# EAGLE design TLC5947_Breakout (EAGLE 6.0)
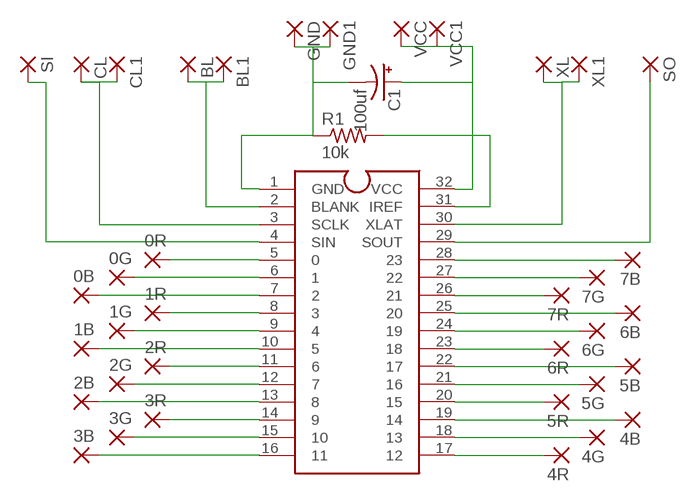
[diagram p0: schematic, sheet 1]

## Parts
0B  SMD2  [SMD1,27-2,54]
0G  SMD2  [SMD1,27-2,54]
0R  SMD2  [SMD1,27-2,54]
1B  SMD2  [SMD1,27-2,54]
1G  SMD2  [SMD1,27-2,54]
1R  SMD2  [SMD1,27-2,54]
2B  SMD2  [SMD1,27-2,54]
2G  SMD2  [SMD1,27-2,54]
2R  SMD2  [SMD1,27-2,54]
3B  SMD2  [SMD1,27-2,54]
3G  SMD2  [SMD1,27-2,54]
3R  SMD2  [SMD1,27-2,54]
4B  SMD2  [SMD1,27-2,54]
4G  SMD2  [SMD1,27-2,54]
4R  SMD2  [SMD1,27-2,54]
5B  SMD2  [SMD1,27-2,54]
5G  SMD2  [SMD1,27-2,54]
5R  SMD2  [SMD1,27-2,54]
6B  SMD2  [SMD1,27-2,54]
6G  SMD2  [SMD1,27-2,54]
6R  SMD2  [SMD1,27-2,54]
7B  SMD2  [SMD1,27-2,54]
7G  SMD2  [SMD1,27-2,54]
7R  SMD2  [SMD1,27-2,54]
BL  SMD2  [SMD1,27-2,54]
BL1  SMD2  [SMD1,27-2,54]
C1  100uf  CPOL-USE2.5-6  [E2,5-6]
CL  SMD2  [SMD1,27-2,54]
CL1  SMD2  [SMD1,27-2,54]
GND  SMD2  [SMD1,27-2,54]
GND1  SMD2  [SMD1,27-2,54]
R1  10k  R-US_0207/10  [0207/10]
SI  SMD2  [SMD1,27-2,54]
SO  SMD2  [SMD1,27-2,54]
U$1  TLC5947DAC  [DAP38]
VCC  SMD2  [SMD1,27-2,54]
VCC1  SMD2  [SMD1,27-2,54]
XL  SMD2  [SMD1,27-2,54]
XL1  SMD2  [SMD1,27-2,54]

## Nets
GND: C1.- GND1.1(P) GND.1(P) R1.1 U$1.1(GND)
N$1: R1.2 U$1.31(IREF)
N$2: U$1.30(XLAT) XL1.1(P) XL.1(P)
N$3: 0R.1(P) U$1.5
N$4: 0G.1(P) U$1.6
N$5: 0B.1(P) U$1.7
N$6: 1R.1(P) U$1.8
N$7: 1G.1(P) U$1.9
N$8: 1B.1(P) U$1.10
N$9: 2R.1(P) U$1.11
N$10: 2G.1(P) U$1.12
N$11: 2B.1(P) U$1.13
N$12: 3R.1(P) U$1.14
N$13: 3G.1(P) U$1.15
N$14: 3B.1(P) U$1.16
N$15: 4R.1(P) U$1.17
N$16: 4G.1(P) U$1.18
N$17: 4B.1(P) U$1.19
N$18: 5R.1(P) U$1.20
N$19: 5G.1(P) U$1.21
N$20: 5B.1(P) U$1.22
N$21: 6R.1(P) U$1.23
N$22: 6G.1(P) U$1.24
N$23: 6B.1(P) U$1.25
N$24: 7R.1(P) U$1.26
N$25: 7G.1(P) U$1.27
N$26: 7B.1(P) U$1.28
N$27: SI.1(P) U$1.4(SIN)
N$28: SO.1(P) U$1.29(SOUT)
N$31: CL1.1(P) CL.1(P) U$1.3(SCLK)
N$32: BL1.1(P) BL.1(P) U$1.2(BLANK)
VCC: C1.+ U$1.32(VCC) VCC1.1(P) VCC.1(P)

## Library data of the parts
0B 0G 0R 1B 1G 1R 2B 2G 2R 3B 3G 3R 4B 4G 4R 5B 5G 5R 6B 6G 6R 7B 7G 7R BL BL1 CL CL1 GND GND1 SI SO VCC VCC1 XL XL1 = wirepad:SMD2: SMD PAD
C1 = resistor:CPOL-US: POLARIZED CAPACITOR, American symbol
R1 = resistor:R-US_: RESISTOR, American symbol
U$1 = RazorConcepts:TLC5947DAC

## Board
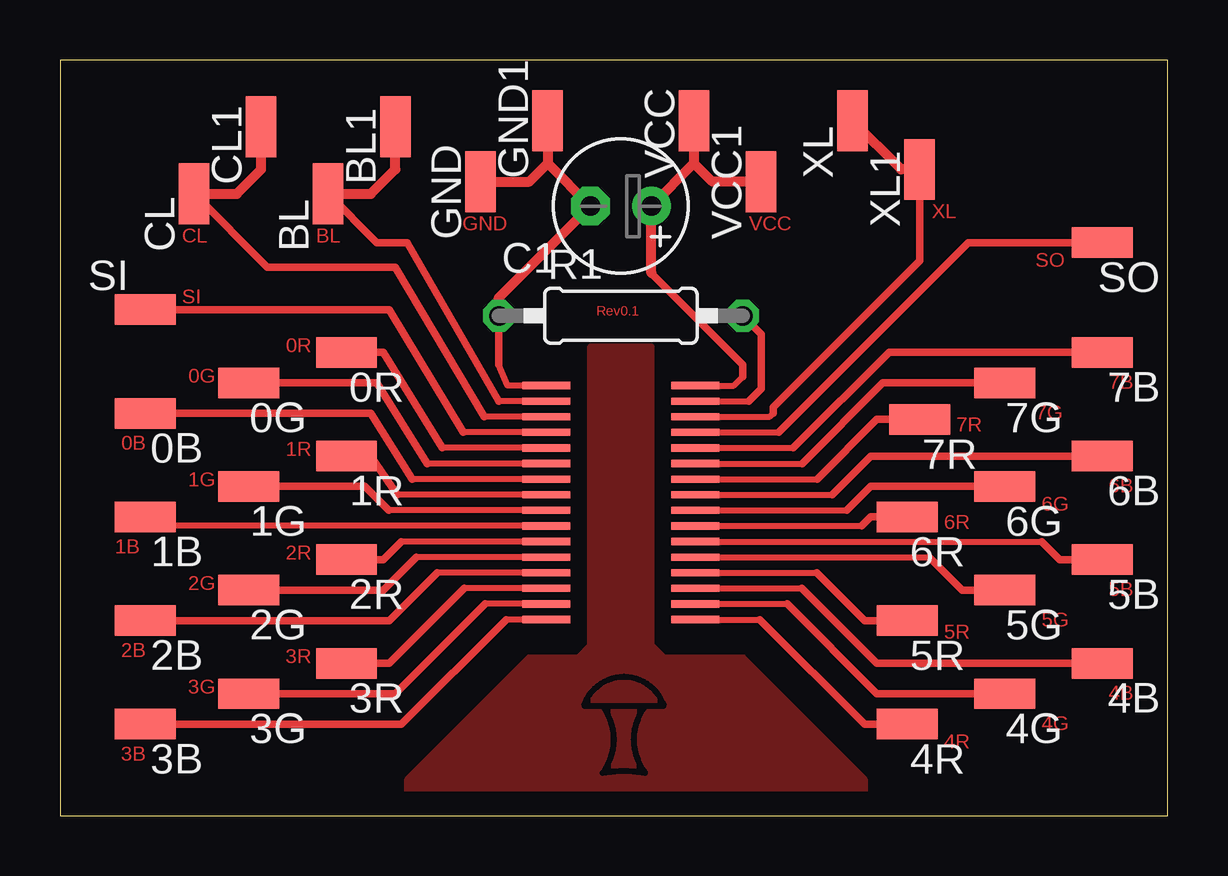
[diagram p1: board, top side]

Size 46.15 x 31.49 mm. Coordinates in mm from the lower left corner, seen from the top.
Outline: 0,0 46.15,0 46.15,31.49 0,31.49 0,0
Copper layers (1*16): Top 0.035mm / dielectric 1.5mm / Bottom 0.035mm
Design rules: minimum track width 10mil, minimum drill 24mil, track to track 8mil, track to pad 8mil, pad to pad 8mil, via to via 8mil, smd to smd 8mil, copper to edge 40mil, drill to drill 8mil, minimum pad ring 10mil, minimum via ring 8mil, stop-mask expansion 4mil, vias tented up to drill 0mil, thermal gap 10mil
tRestrict: 7 lines

### Footprints (pad centres in the part's own frame; a part is rotated, then mirrored left to right if it is on the bottom)
SMD1,27-2,54 = smd 1.27 x 2.54: 1 0,0
E2,5-6 = drill 0.813 pad 1.6: + -1.27,0 | drill 0.813 pad 1.6 octagon: - 1.27,0
0207/10 = drill 0.813 octagon: 1 -5.08,0; 2 5.08,0
DAP38 = smd 2 x 0.3: 1 -3.1,0.65; 2 -3.1,0; 3 -3.1,-0.65; 4 -3.1,-1.3; 5 -3.1,-1.95; 6 -3.1,-2.6; 7 -3.1,-3.25; 8 -3.1,-3.9; 9 -3.1,-4.55; 10 -3.1,-5.2; 11 -3.1,-5.85; 12 -3.1,-6.5; 13 -3.1,-7.15; 14 -3.1,-7.8; 15 -3.1,-8.45; 16 -3.1,-9.1; 17 3.1,-9.1; 18 3.1,-8.45; 19 3.1,-7.8; 20 3.1,-7.15; 21 3.1,-6.5; 22 3.1,-5.85; 23 3.1,-5.2; 24 3.1,-4.55; 25 3.1,-3.9; 26 3.1,-3.25; 27 3.1,-2.6; 28 3.1,-1.95; 29 3.1,-1.3; 30 3.1,-0.65; 31 3.1,0; 32 3.1,0.65

### Placement (x,y rotation side)
0B  3.56,16.76 90 top
0G  7.87,18.03 90 top
0R  11.94,19.3 90 top
1B  3.56,12.45 90 top
1G  7.87,13.72 90 top
1R  11.94,14.99 90 top
2B  3.56,8.13 90 top
2G  7.87,9.4 90 top
2R  11.94,10.67 90 top
3B  3.56,3.81 90 top
3G  7.87,5.08 90 top
3R  11.94,6.35 90 top
4B  43.43,6.35 90 top
4G  39.37,5.08 90 top
4R  35.31,3.81 90 top
5B  43.43,10.67 90 top
5G  39.37,9.4 90 top
5R  35.31,8.13 90 top
6B  43.43,14.99 90 top
6G  39.37,13.72 90 top
6R  35.31,12.45 90 top
7B  43.43,19.3 90 top
7G  39.37,18.03 90 top
7R  35.81,16.51 90 top
BL  11.18,25.91 0 top
BL1  13.97,28.7 0 top
C1  23.37,25.4 180 top
CL  5.59,25.91 0 top
CL1  8.38,28.7 0 top
GND  17.53,26.42 0 top
GND1  20.32,28.96 0 top
R1  23.37,20.83 0 top
SI  3.56,21.08 270 top
SO  43.43,23.88 90 top
U$1  23.37,17.27 0 top
VCC  26.42,28.96 0 top
VCC1  29.21,26.42 0 top
XL  33.02,28.96 0 top
XL1  35.81,26.92 0 top

### Tracks (layer width: path | path; a pad name or v marks a point on that pad's centre or on a via)
GND
  Top 0.254: U$1.1 18.65,17.92 18.29,18.8
  Top 0.305: 18.29,18.8 R1.1
  Top 0.406: R1.1 18.29,21.59 C1.- 20.32,27.18 | GND.1 19.56,26.42 20.32,27.18 | GND1.1 20.32,27.18
N$1
  Top 0.254: U$1.31 28.7,17.27
  Top 0.305: 28.7,17.27 29.21,17.78 29.21,20.07 R1.2
N$2
  Top 0.254: U$1.30 29.58,16.62 29.72,16.76
  Top 0.305: 29.72,16.76 29.72,17.02 35.81,23.11 XL1.1
  Top 0.406: XL1.1 35.05,26.92 XL.1
N$3
  Top 0.254: U$1.5 15.92,15.32
  Top 0.305: 15.92,15.32 13.46,19.3 0R.1
N$4
  Top 0.254: U$1.6 15.3,14.67
  Top 0.305: 15.3,14.67 13.21,18.03 0G.1
N$5
  Top 0.254: U$1.7 14.68,14.02
  Top 0.305: 14.68,14.02 12.95,16.76 0B.1
N$6
  Top 0.254: U$1.8 14.06,13.37
  Top 0.305: 14.06,13.37 12.95,14.99 1R.1
N$7
  Top 0.254: U$1.9 13.69,12.72
  Top 0.305: 13.69,12.72 12.7,13.72 1G.1
N$8
  Top 0.254: U$1.10 3.93,12.07 1B.1
N$9
  Top 0.254: U$1.11 14.22,11.42
  Top 0.305: 14.22,11.42 13.46,10.67 2R.1
N$10
  Top 0.254: U$1.12 14.84,10.77
  Top 0.305: 14.84,10.77 13.46,9.4 2G.1
N$11
  Top 0.254: U$1.13 15.71,10.12
  Top 0.305: 15.71,10.12 13.72,8.13 2B.1
N$12
  Top 0.254: U$1.14 16.84,9.47
  Top 0.305: 16.84,9.47 13.72,6.35 3R.1
N$13
  Top 0.254: U$1.15 17.71,8.82
  Top 0.305: 17.71,8.82 13.97,5.08 3G.1
N$14
  Top 0.254: U$1.16 18.59,8.17
  Top 0.305: 18.59,8.17 14.22,3.81 3B.1
N$15
  Top 0.254: U$1.17 29.17,8.17
  Top 0.305: 29.17,8.17 33.53,3.81 4R.1
N$16
  Top 0.254: U$1.18 30.29,8.82
  Top 0.305: 30.29,8.82 34.04,5.08 4G.1
N$17
  Top 0.254: U$1.19 30.91,9.47
  Top 0.305: 30.91,9.47 34.04,6.35 4B.1
N$18
  Top 0.254: U$1.20 31.53,10.12
  Top 0.305: 31.53,10.12 33.53,8.13 5R.1
N$19
  Top 0.254: U$1.21 36.22,10.77
  Top 0.305: 36.22,10.77 37.59,9.4 5G.1
N$20
  Top 0.254: U$1.22 40.9,11.42
  Top 0.305: 40.9,11.42 41.66,10.67 5B.1
N$21
  Top 0.254: U$1.23 33.41,12.07
  Top 0.305: 33.41,12.07 33.78,12.45 6R.1
N$22
  Top 0.254: U$1.24 32.79,12.72
  Top 0.305: 32.79,12.72 33.78,13.72 6G.1
N$23
  Top 0.254: U$1.25 32.17,13.37
  Top 0.305: 32.17,13.37 33.78,14.99 6B.1
N$24
  Top 0.254: U$1.26 31.55,14.02
  Top 0.305: 31.55,14.02 34.04,16.51 7R.1
N$25
  Top 0.254: U$1.27 30.93,14.67
  Top 0.305: 30.93,14.67 34.29,18.03 7G.1
N$26
  Top 0.254: U$1.28 30.56,15.32
  Top 0.305: 30.56,15.32 34.54,19.3 7B.1
N$27
  Top 0.254: U$1.4 16.79,15.97
  Top 0.305: 16.79,15.97 13.72,21.08 SI.1
N$28
  Top 0.254: U$1.29 29.94,15.97
  Top 0.305: 29.94,15.97 37.85,23.88 SO.1
N$29
  pour Top: 22.1,19.56 24.64,19.56 24.64,7.11 25.15,6.6 28.45,6.6 33.53,1.52 33.53,0.51 14.48,0.51 14.48,1.52 19.56,6.6 21.59,6.6 22.1,7.11
N$31
  Top 0.254: U$1.3 17.67,16.62
  Top 0.305: 17.67,16.62 13.97,22.86 8.64,22.86 CL.1
  Top 0.406: CL.1 7.37,25.91 8.38,26.92 CL1.1
N$32
  Top 0.254: U$1.2 18.29,17.27
  Top 0.305: 18.29,17.27 14.48,23.88 13.21,23.88 BL.1
  Top 0.406: BL.1 12.95,25.91 13.97,26.92 BL1.1
VCC
  Top 0.254: U$1.32 28.08,17.92 28.45,18.29
  Top 0.305: 28.45,18.29 28.45,18.8 24.64,22.61
  Top 0.406: 24.64,22.61 C1.+ 26.42,27.18 | VCC1.1 27.18,26.42 26.42,27.18 | VCC.1 26.42,27.18

### Text on the board
Top: XL | CL | BL | GND | VCC | SO | SI | Rev0.1 | 0R | 0G | 7B | 7G | 7R | 0B | 1R | 1G | 6G | 6B | 6R | 1B | 2R | 2G | 5B | 5G | 2B | 5R | 3R | 3G | 4B | 4G | 4R | 3B